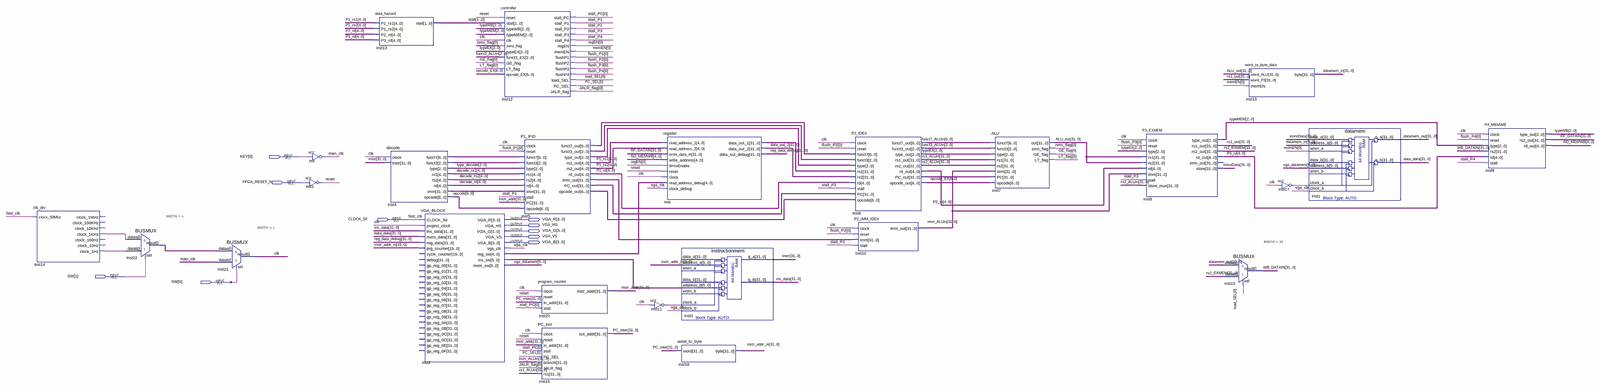
[diagram p0: schematic sheet, whole]
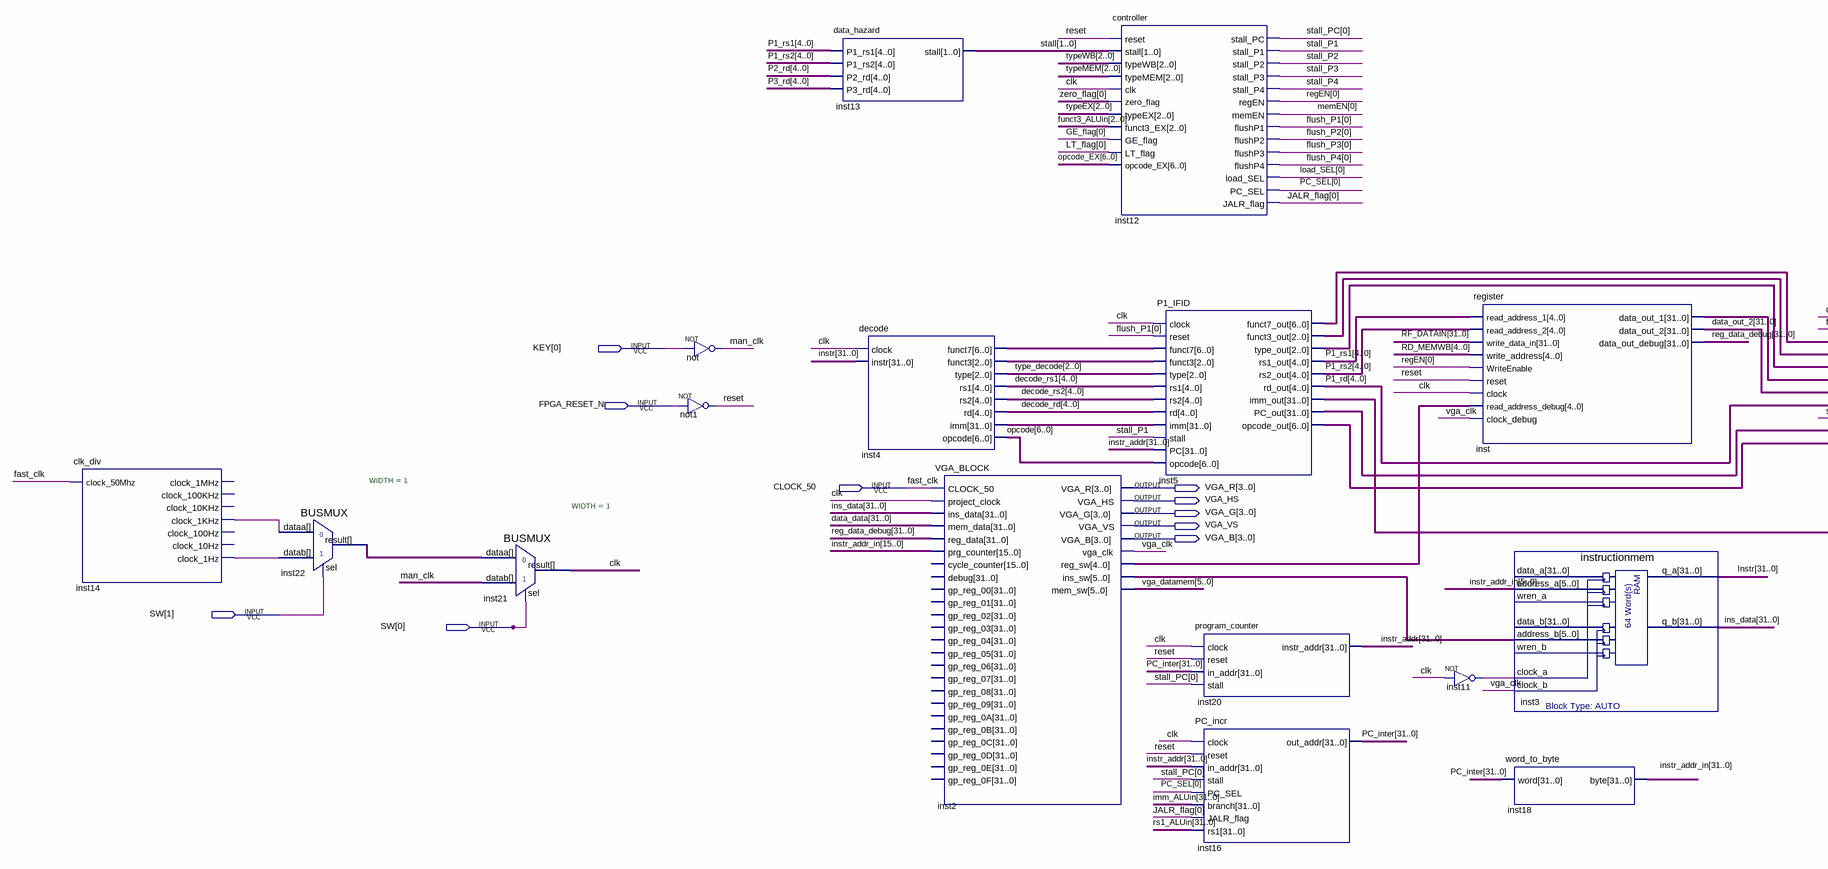
[diagram p1: schematic sheet, left part]
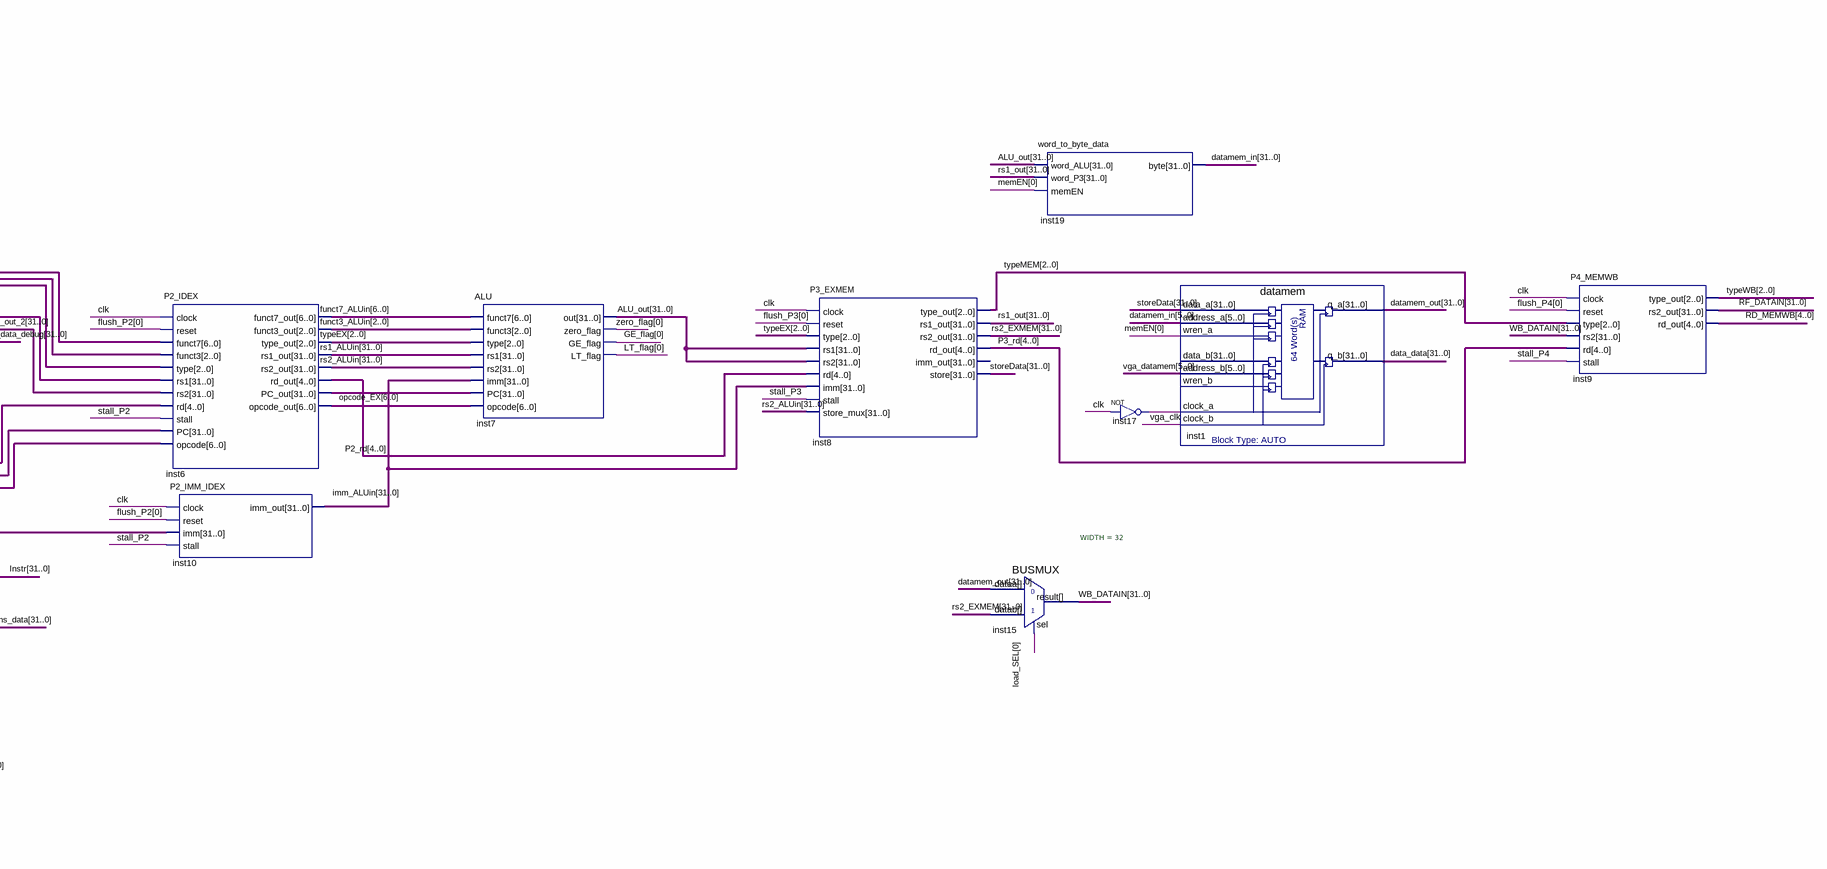
[diagram p2: schematic sheet, right part]
// Quartus schematic reg_mem.bdf as structural Verilog: 25 symbols, 10 pins
module reg_mem (
  input  [0:0] KEY,
  input  FPGA_RESET_N,
  input  CLOCK_50,
  input  [1:0] SW,
  output [3:0] VGA_R,
  output VGA_HS,
  output [3:0] VGA_G,
  output VGA_VS,
  output [3:0] VGA_B
);

  wire clk, inst11_out, inst14_clock_1hz, inst14_clock_1khz, inst17_out, inst22_result, man_clk, reset,
       stall_P1, stall_P2, stall_P3, stall_P4, vga_clk;
  wire [0:0] flush_P1, flush_P2, flush_P3, flush_P4, GE_flag, JALR_flag, load_SEL, LT_flag, memEN, PC_SEL,
       regEN, stall_PC, zero_flag;
  wire [1:0] stall;
  wire [2:0] funct3_ALUin, inst4_funct3, inst5_funct3_out, inst5_type_out, type_decode, typeEX, typeMEM,
       typeWB;
  wire [4:0] decode_rd, decode_rs1, decode_rs2, inst2_reg_sw, P1_rd, P1_rs1, P1_rs2, P2_rd, P3_rd, RD_MEMWB;
  wire [5:0] inst2_ins_sw, vga_datamem;
  wire [6:0] funct7_ALUin, inst4_funct7, inst5_funct7_out, inst5_opcode_out, opcode, opcode_EX;
  wire [31:0] ALU_out, data_data, data_out_2, datamem_in, datamem_out, imm_ALUin, ins_data, inst4_imm,
       inst5_imm_out, inst5_pc_out, inst6_pc_out, inst_data_out_1, Instr, instr_addr, instr_addr_in,
       PC_inter, reg_data_debug, RF_DATAIN, rs1_ALUin, rs1_out, rs2_ALUin, rs2_EXMEM, storeData, WB_DATAIN;

  clk_div inst14 (
    .clock_50Mhz(CLOCK_50), .clock_1KHz(inst14_clock_1khz), .clock_1Hz(inst14_clock_1hz));  // open: clock_1MHz, clock_100KHz, clock_10KHz, clock_100Hz, clock_10Hz
  BUSMUX #(.WIDTH(1)) inst22 (.datab(inst14_clock_1hz), .sel(SW[1]), .dataa(inst14_clock_1khz), .result(inst22_result));
  BUSMUX #(.WIDTH(1)) inst21 (.datab(man_clk), .sel(SW[0]), .dataa(inst22_result), .result(clk));
  not \not  (man_clk, KEY[0]);
  not not1 (reset, FPGA_RESET_N);
  data_hazard inst13 (.P1_rs1(P1_rs1), .P1_rs2(P1_rs2), .P2_rd(P2_rd), .P3_rd(P3_rd), .stall(stall));
  decode inst4 (
    .clock(clk), .instr(Instr), .funct7(inst4_funct7), .funct3(inst4_funct3), .\type (type_decode),
    .rs1(decode_rs1), .rs2(decode_rs2), .rd(decode_rd), .imm(inst4_imm), .opcode(opcode));
  VGA_BLOCK inst2 (
    .CLOCK_50(CLOCK_50), .project_clock(clk), .ins_data(ins_data), .mem_data(data_data),
    .reg_data(reg_data_debug), .prg_counter(instr_addr_in[15:0]), .VGA_R(VGA_R), .VGA_HS(VGA_HS),
    .VGA_G(VGA_G), .VGA_VS(VGA_VS), .VGA_B(VGA_B), .vga_clk(vga_clk), .reg_sw(inst2_reg_sw),
    .ins_sw(inst2_ins_sw), .mem_sw(vga_datamem));  // open: cycle_counter, debug, gp_reg_00, gp_reg_01, gp_reg_02, gp_reg_03, gp_reg_04, gp_reg_05, gp_reg_06, gp_reg_07, gp_reg_08, gp_reg_09, gp_reg_0A, gp_reg_0B, gp_reg_0C, gp_reg_0D, gp_reg_0E, gp_reg_0F
  controller inst12 (
    .reset(reset), .stall(stall), .typeWB(typeWB), .typeMEM(typeMEM), .clk(clk), .zero_flag(zero_flag[0]),
    .typeEX(typeEX), .funct3_EX(funct3_ALUin), .GE_flag(GE_flag[0]), .LT_flag(LT_flag[0]),
    .opcode_EX(opcode_EX), .stall_PC(stall_PC[0]), .stall_P1(stall_P1), .stall_P2(stall_P2),
    .stall_P3(stall_P3), .stall_P4(stall_P4), .regEN(regEN[0]), .memEN(memEN[0]), .flushP1(flush_P1[0]),
    .flushP2(flush_P2[0]), .flushP3(flush_P3[0]), .flushP4(flush_P4[0]), .load_SEL(load_SEL[0]),
    .PC_SEL(PC_SEL[0]), .JALR_flag(JALR_flag[0]));
  P1_IFID inst5 (
    .clock(clk), .reset(flush_P1[0]), .funct7(inst4_funct7), .funct3(inst4_funct3), .\type (type_decode),
    .rs1(decode_rs1), .rs2(decode_rs2), .rd(decode_rd), .imm(inst4_imm), .stall(stall_P1), .PC(instr_addr),
    .opcode(opcode), .funct7_out(inst5_funct7_out), .funct3_out(inst5_funct3_out), .type_out(inst5_type_out),
    .rs1_out(P1_rs1), .rs2_out(P1_rs2), .rd_out(P1_rd), .imm_out(inst5_imm_out), .PC_out(inst5_pc_out),
    .opcode_out(inst5_opcode_out));
  program_counter inst20 (.clock(clk), .reset(reset), .in_addr(PC_inter), .stall(stall_PC[0]), .instr_addr(instr_addr));
  PC_incr inst16 (
    .clock(clk), .reset(reset), .in_addr(instr_addr), .stall(stall_PC[0]), .PC_SEL(PC_SEL[0]),
    .branch(imm_ALUin), .JALR_flag(JALR_flag[0]), .rs1(rs1_ALUin), .out_addr(PC_inter));
  not inst11 (inst11_out, clk);
  register inst (
    .read_address_1(P1_rs1), .read_address_2(P1_rs2), .write_data_in(RF_DATAIN), .write_address(RD_MEMWB),
    .WriteEnable(regEN[0]), .reset(reset), .clock(clk), .read_address_debug(inst2_reg_sw),
    .clock_debug(vga_clk), .data_out_1(inst_data_out_1), .data_out_2(data_out_2),
    .data_out_debug(reg_data_debug));
  instructionmem inst3 (
    .address_a(instr_addr_in[5:0]), .address_b(inst2_ins_sw), .clock_a(inst11_out), .clock_b(vga_clk),
    .q_a(Instr), .q_b(ins_data));  // open: data_a, wren_a, data_b, wren_b
  word_to_byte inst18 (.word(PC_inter), .\byte (instr_addr_in));
  P2_IDEX inst6 (
    .clock(clk), .reset(flush_P2[0]), .funct7(inst5_funct7_out), .funct3(inst5_funct3_out),
    .\type (inst5_type_out), .rs1(inst_data_out_1), .rs2(data_out_2), .rd(P1_rd), .stall(stall_P2),
    .PC(inst5_pc_out), .opcode(inst5_opcode_out), .funct7_out(funct7_ALUin), .funct3_out(funct3_ALUin),
    .type_out(typeEX), .rs1_out(rs1_ALUin), .rs2_out(rs2_ALUin), .rd_out(P2_rd), .PC_out(inst6_pc_out),
    .opcode_out(opcode_EX));
  P2_IMM_IDEX inst10 (.clock(clk), .reset(flush_P2[0]), .imm(inst5_imm_out), .stall(stall_P2), .imm_out(imm_ALUin));
  ALU inst7 (
    .funct7(funct7_ALUin), .funct3(funct3_ALUin), .\type (typeEX), .rs1(rs1_ALUin), .rs2(rs2_ALUin),
    .imm(imm_ALUin), .PC(inst6_pc_out), .opcode(opcode_EX), .out(ALU_out), .zero_flag(zero_flag[0]),
    .GE_flag(GE_flag[0]), .LT_flag(LT_flag[0]));
  P3_EXMEM inst8 (
    .clock(clk), .reset(flush_P3[0]), .\type (typeEX), .rs1(ALU_out), .rs2(ALU_out), .rd(P2_rd),
    .imm(imm_ALUin), .stall(stall_P3), .store_mux(rs2_ALUin), .type_out(typeMEM), .rs1_out(rs1_out),
    .rs2_out(rs2_EXMEM), .rd_out(P3_rd), .store(storeData));  // open: imm_out
  BUSMUX #(.WIDTH(32)) inst15 (.datab(rs2_EXMEM), .sel(load_SEL[0]), .dataa(datamem_out), .result(WB_DATAIN));
  word_to_byte_data inst19 (.word_ALU(ALU_out), .word_P3(rs1_out), .memEN(memEN[0]), .\byte (datamem_in));
  not inst17 (inst17_out, clk);
  datamem inst1 (
    .data_a(storeData), .address_a(datamem_in[5:0]), .wren_a(memEN[0]), .address_b(vga_datamem),
    .clock_a(inst17_out), .clock_b(vga_clk), .q_a(datamem_out), .q_b(data_data));  // open: data_b, wren_b
  P4_MEMWB inst9 (
    .clock(clk), .reset(flush_P4[0]), .\type (typeMEM), .rs2(WB_DATAIN), .rd(P3_rd), .stall(stall_P4),
    .type_out(typeWB), .rs2_out(RF_DATAIN), .rd_out(RD_MEMWB));

  // Other names for the same wires on the sheet: fast_clk = CLOCK_50
endmodule
